# EAGLE design 10LA.org_Raspiado_Updated_Logo_Oct3 (EAGLE 7.1.0)

## Sheet 1 of 3
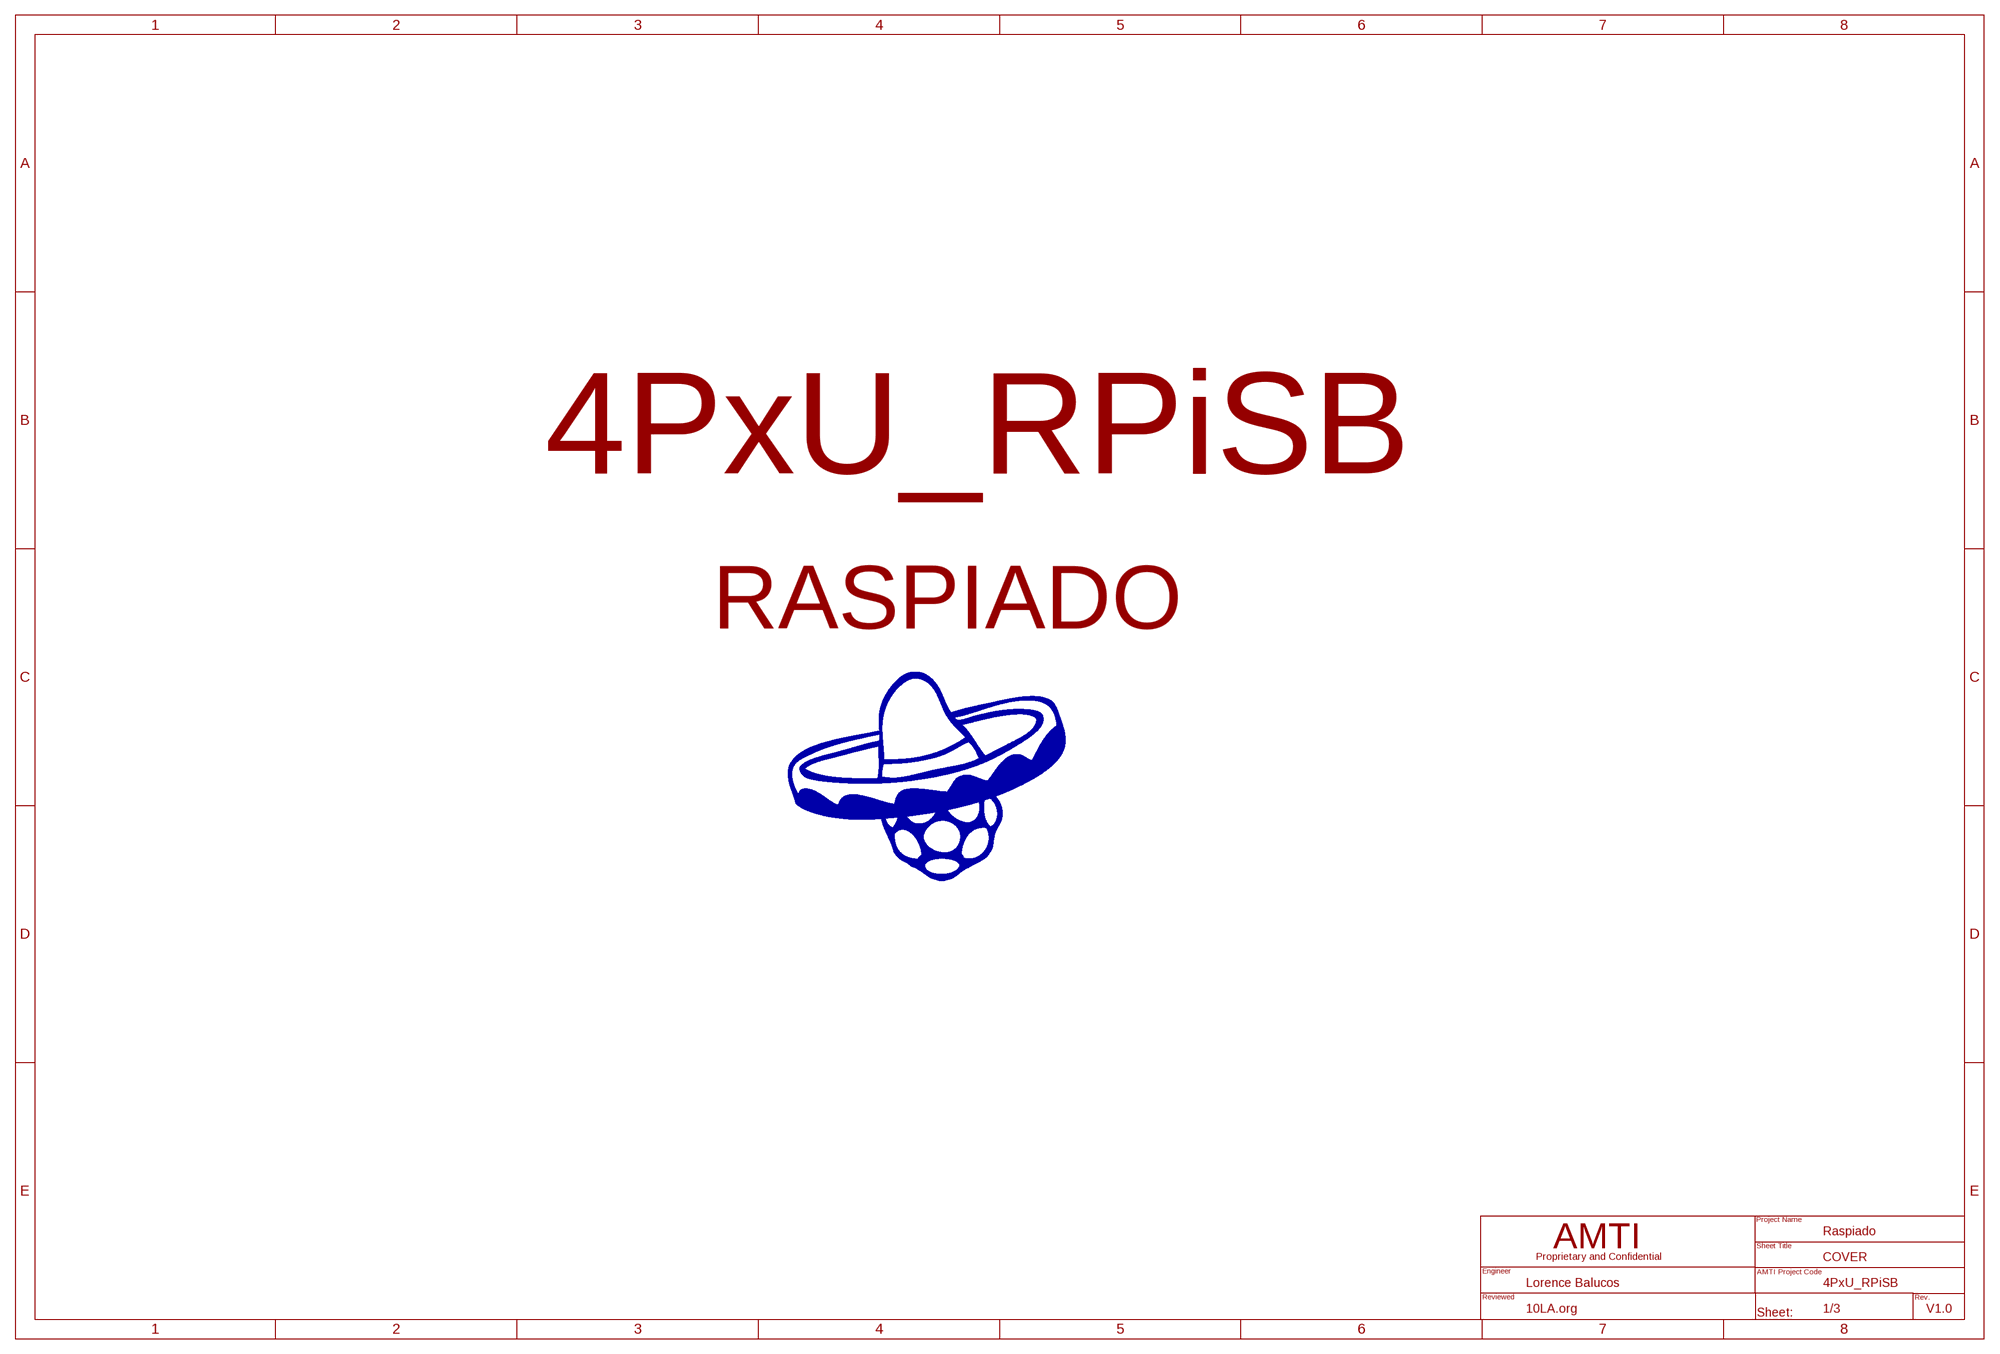
[diagram p0: schematic, sheet 1]

### Notes on the sheet
- 4PxU_RPiSB
- RASPIADO
- Raspiado
- COVER
- Lorence Balucos | 4PxU_RPiSB
- 10LA.org | 1/3 | V1.0

## Sheet 2 of 3
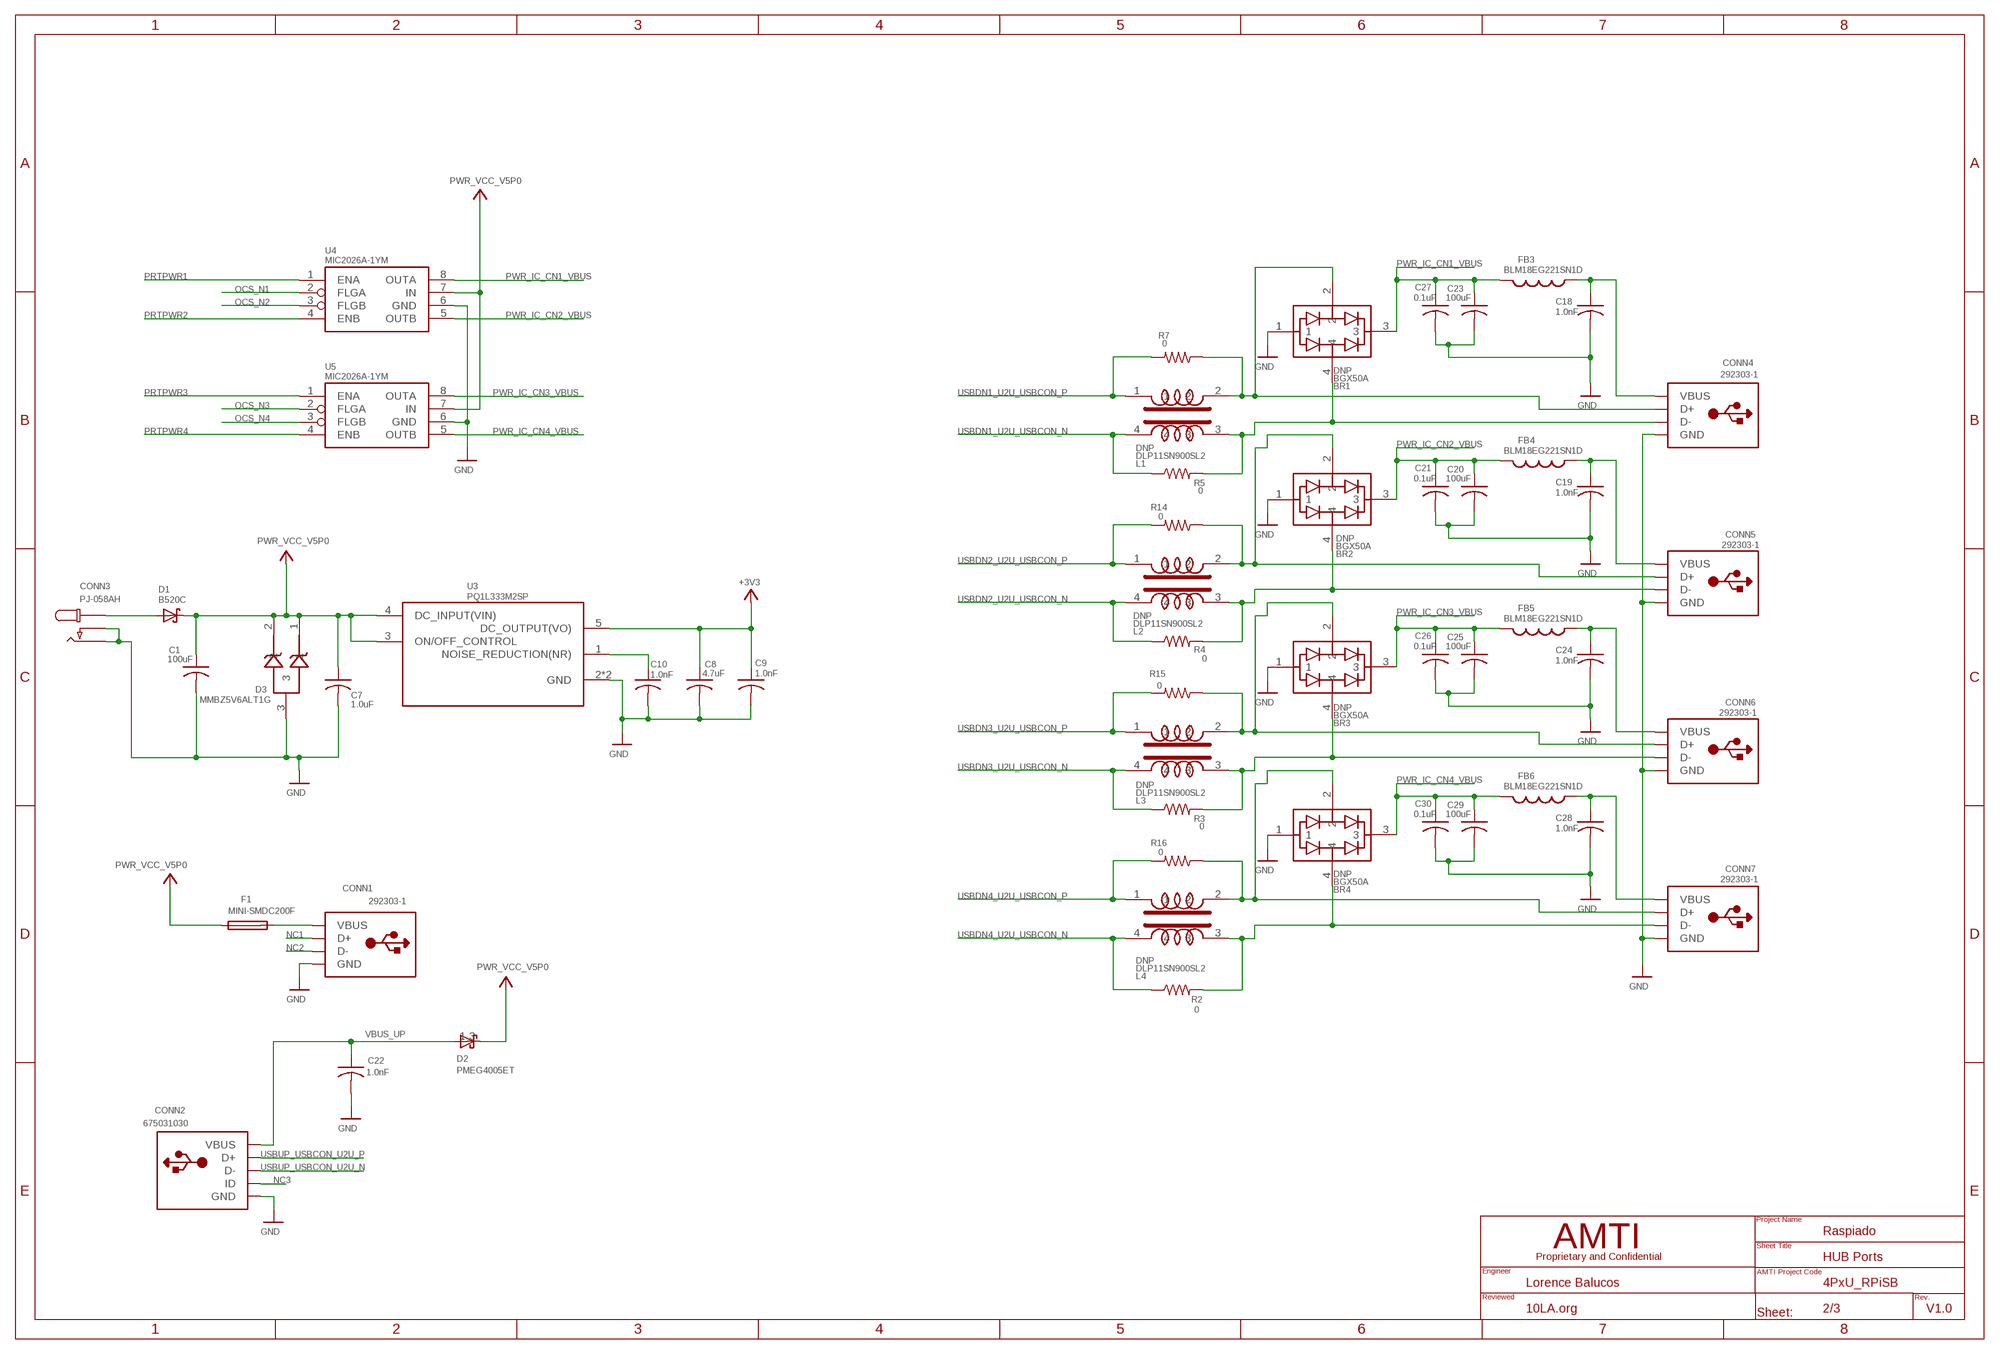
[diagram p1: schematic, sheet 2]

### Parts
BR1  BGX50A  [SOT-143]
BR2  BGX50A  [SOT-143]
BR3  BGX50A  [SOT-143]
BR4  BGX50A  [SOT-143]
C1  100uF  EMZA6R3ADA101ME61G  [RADIAL_SMT]
C7  1.0uF  C-USC0603  [C0603]
C8  4.7uF  C-USC0603  [C0603]
C9  1.0nF  C-USC0402  [0402]
C10  1.0nF  C-USC0402  [0402]
C18  1.0nF  C-USC0402  [0402]
C19  1.0nF  C-USC0402  [0402]
C20  100uF  EMZA6R3ADA101ME61G  [RADIAL_SMT]
C21  0.1uF  C-USC0402  [0402]
C22  1.0nF  C-USC0402  [0402]
C23  100uF  EMZA6R3ADA101ME61G  [RADIAL_SMT]
C24  1.0nF  C-USC0402  [0402]
C25  100uF  EMZA6R3ADA101ME61G  [RADIAL_SMT]
C26  0.1uF  C-USC0402  [0402]
C27  0.1uF  C-USC0402  [0402]
C28  1.0nF  C-USC0402  [0402]
C29  100uF  EMZA6R3ADA101ME61G  [RADIAL_SMT]
C30  0.1uF  C-USC0402  [0402]
CONN1  292303-1  USB_292303-1  [STYLEA,RIGHTANGLE,THROUGH-HOLE]
CONN2  675031030  675031030-USB_MINI-B  [MINI_B]
CONN3  PJ-058AH  [PJ-058AH]
CONN4  292303-1  USB_292303-1  [STYLEA,RIGHTANGLE,THROUGH-HOLE]
CONN5  292303-1  USB_292303-1  [STYLEA,RIGHTANGLE,THROUGH-HOLE]
CONN6  292303-1  USB_292303-1  [STYLEA,RIGHTANGLE,THROUGH-HOLE]
CONN7  292303-1  USB_292303-1  [STYLEA,RIGHTANGLE,THROUGH-HOLE]
D1  B520C  [B520C]
D2  PMEG4005ET  [SOT23]
D3  MMBZ5V6ALT1G  MMBZ_ALT1G  [SOT23]
F1  MINI-SMDC200F  MINI-SMDC-200F  [MINI-SMDC200F]
FB3  BLM18EG221SN1D  [C0603]
FB4  BLM18EG221SN1D  [C0603]
FB5  BLM18EG221SN1D  [C0603]
FB6  BLM18EG221SN1D  [C0603]
L1  DLP11SN900SL2  [0504]
L2  DLP11SN900SL2  [0504]
L3  DLP11SN900SL2  [0504]
L4  DLP11SN900SL2  [0504]
R2  0  R-US_R0402  [R0402]
R3  0  R-US_R0402  [R0402]
R4  0  R-US_R0402  [R0402]
R5  0  R-US_R0402  [R0402]
R7  0  R-US_R0402  [R0402]
R14  0  R-US_R0402  [R0402]
R15  0  R-US_R0402  [R0402]
R16  0  R-US_R0402  [R0402]
U3  PQ1L333M2SP  [PQ1L333M2SP]
U4  MIC2026A-1YM  [SO_08]
U5  MIC2026A-1YM  [SO_08]

### Nets
+3V3: C8.1 C9.1 U3.5(DC_OUTPUT(VO)) ; also sheet 3
GND: BR1.1 BR2.1 BR3.1 BR4.1 C1.- C7.2 C8.2 C9.2 C10.2 C18.2 C19.2 C20.- C21.2 C22.2 C23.- C24.2 C25.- C26.2 C27.2 C28.2 C29.- C30.2 CONN1.GND CONN1.GND1(GND) CONN1.GND2(GND) CONN2.GND CONN2.GND1(GND) CONN2.GND2(GND) CONN2.GND3(GND) CONN2.GND4(GND) CONN3.2 CONN3.3 CONN4.GND CONN4.GND1(GND) CONN4.GND2(GND) CONN5.GND CONN5.GND1(GND) CONN5.GND2(GND) CONN6.GND CONN6.GND1(GND) CONN6.GND2(GND) CONN7.GND CONN7.GND1(GND) CONN7.GND2(GND) D3.3 U3.2(GND) U3.P$3(GND) U4.6(GND) U5.6(GND) ; also sheet 3
N$6: C19.1 CONN5.VBUS FB4.1
N$7: BR2.2 CONN5.SIG2(D+) L2.2 R14.1
N$9: CONN3.1 D1.P$1
N$15: C10.1 U3.1(NOISE_REDUCTION(NR))
N$17: C18.1 CONN4.VBUS FB3.1
N$18: BR1.2 CONN4.SIG2(D+) L1.2 R7.1
N$19: CONN1.VBUS F1.2
N$25: C24.1 CONN6.VBUS FB5.1
N$27: BR3.2 CONN6.SIG2(D+) L3.2 R15.1
N$29: C28.1 CONN7.VBUS FB6.1
N$30: BR4.2 CONN7.SIG2(D+) L4.2 R16.1
NC1: CONN1.SIG2(D+)
NC2: CONN1.SIG1(D-)
NC3: CONN2.ID
OCS_N1: U4.2(FLGA) ; also sheet 3
OCS_N2: U4.3(FLGB) ; also sheet 3
OCS_N3: U5.2(FLGA) ; also sheet 3
OCS_N4: U5.3(FLGB) ; also sheet 3
PRTPWR1: U4.1(ENA) ; also sheet 3
PRTPWR2: U4.4(ENB) ; also sheet 3
PRTPWR3: U5.1(ENA) ; also sheet 3
PRTPWR4: U5.4(ENB) ; also sheet 3
PWR_IC_CN1_VBUS: BR1.3 C23.+ C27.1 FB3.2 U4.8(OUTA)
PWR_IC_CN2_VBUS: BR2.3 C20.+ C21.1 FB4.2 U4.5(OUTB)
PWR_IC_CN3_VBUS: BR3.3 C25.+ C26.1 FB5.2 U5.8(OUTA)
PWR_IC_CN4_VBUS: BR4.3 C29.+ C30.1 FB6.2 U5.5(OUTB)
USBDN1_U2U_USBCON_N: L1.4 R5.1 ; also sheet 3
USBDN1_U2U_USBCON_P: L1.1 R7.2 ; also sheet 3
USBDN1_U2U_USBCON_P2: BR4.4 CONN7.SIG1(D-) L4.3 R2.2
USBDN1_U2U_USBCON_P3: BR3.4 CONN6.SIG1(D-) L3.3 R3.2
USBDN1_U2U_USBCON_P4: BR2.4 CONN5.SIG1(D-) L2.3 R4.2
USBDN1_U2U_USBCON_P5: BR1.4 CONN4.SIG1(D-) L1.3 R5.2
USBDN2_U2U_USBCON_N: L2.4 R4.1 ; also sheet 3
USBDN2_U2U_USBCON_P: L2.1 R14.2 ; also sheet 3
USBDN3_U2U_USBCON_N: L3.4 R3.1 ; also sheet 3
USBDN3_U2U_USBCON_P: L3.1 R15.2 ; also sheet 3
USBDN4_U2U_USBCON_N: L4.4 R2.1 ; also sheet 3
USBDN4_U2U_USBCON_P: L4.1 R16.2 ; also sheet 3
USBUP_USBCON_U2U_N: CONN2.D- ; also sheet 3
USBUP_USBCON_U2U_P: CONN2.D+ ; also sheet 3
VBUS_UP: C22.1 CONN2.VBUS D2.1 ; also sheet 3
VCC: C1.+ C7.1 D1.P$2 D2.3 D3.1 D3.2 F1.1 U3.3(ON/OFF_CONTROL) U3.4(DC_INPUT(VIN)) U4.7(IN) U5.7(IN) ; supply symbol labelled PWR_VCC_V5P0

### Notes on the sheet
- Raspiado
- HUB Ports
- Lorence Balucos | 4PxU_RPiSB
- 10LA.org | 2/3 | V1.0

## Sheet 3 of 3
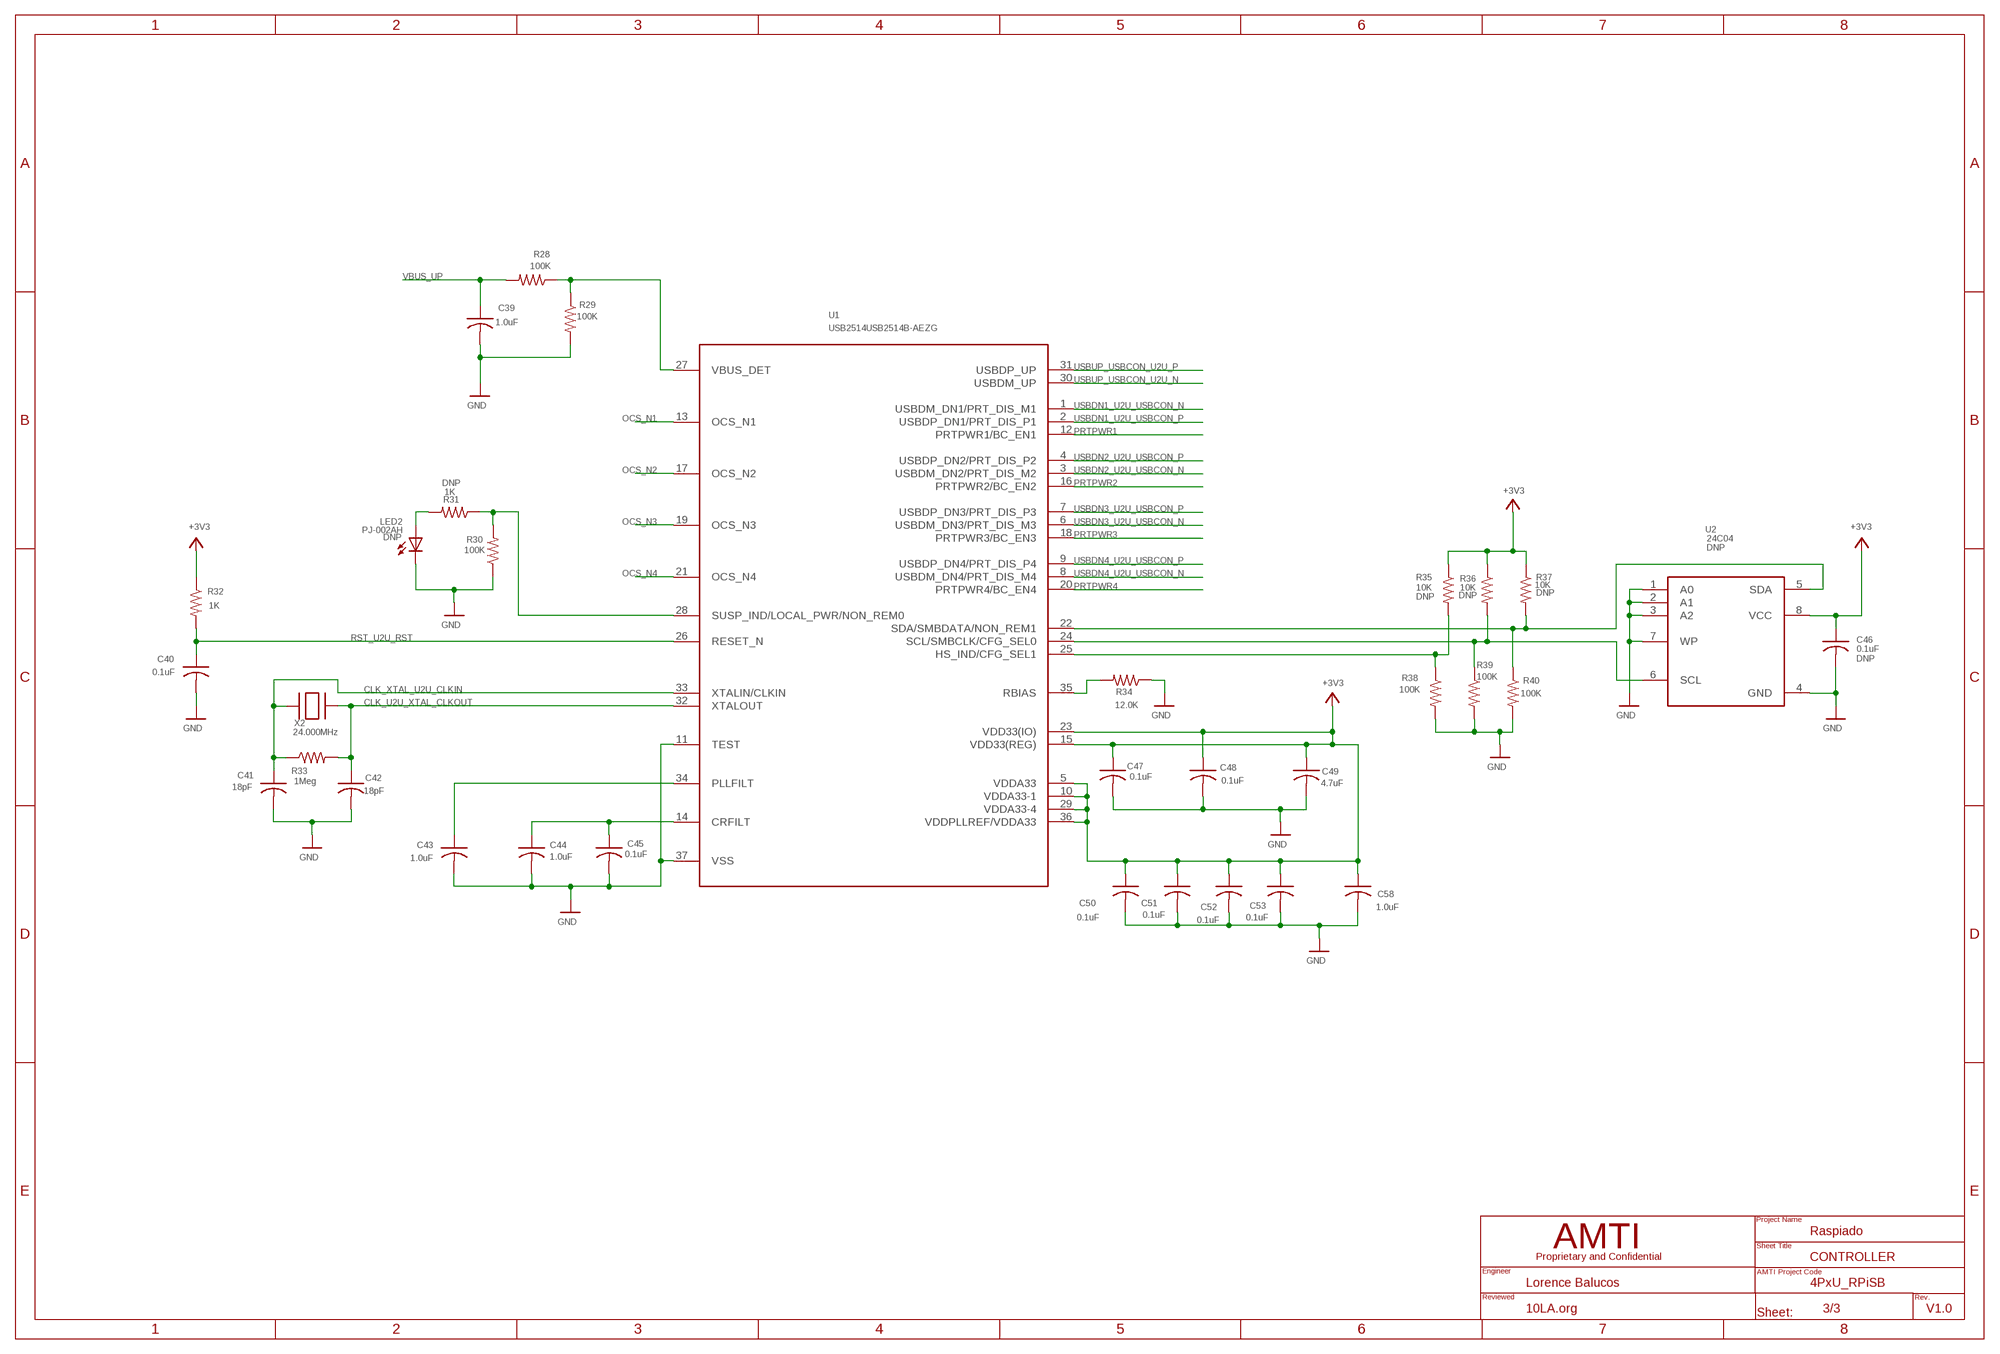
[diagram p2: schematic, sheet 3]

### Parts
C39  1.0uF  C-USC0603  [C0603]
C40  0.1uF  C-USC0402  [0402]
C41  18pF  C-USC0402  [0402]
C42  18pF  C-USC0402  [0402]
C43  1.0uF  C-USC0402  [0402]
C44  1.0uF  C-USC0402  [0402]
C45  0.1uF  C-USC0402  [0402]
C46  0.1uF  C-USC0402  [0402]
C47  0.1uF  C-USC0402  [0402]
C48  0.1uF  C-USC0402  [0402]
C49  4.7uF  C-USC0603  [C0603]
C50  0.1uF  C-USC0402  [0402]
C51  0.1uF  C-USC0402  [0402]
C52  0.1uF  C-USC0402  [0402]
C53  0.1uF  C-USC0402  [0402]
C58  1.0uF  C-USC0603  [C0603]
LED2  PJ-002AH  LEDCHIPLED_0603  [0603]
R28  100K  R-US_R0603  [R0603]
R29  100K  R-US_R0603  [R0603]
R30  100K  R-US_R0603  [R0603]
R31  1K  R-US_R0603  [R0603]
R32  1K  R-US_R0603  [R0603]
R33  1Meg  R-US_R0603  [R0603]
R34  12.0K  R-US_R0603  [R0603]
R35  10K  R-US_R0603  [R0603]
R36  10K  R-US_R0603  [R0603]
R37  10K  R-US_R0603  [R0603]
R38  100K  R-US_R0603  [R0603]
R39  100K  R-US_R0603  [R0603]
R40  100K  R-US_R0603  [R0603]
U1  USB2514USB2514B-AEZG  [QFN36]
U2  24C04  [SO-8]
X2  24.000MHz  HCM49-24.000MABJ-UT  [HC-49SMT]

### Nets
+3V3: C46.1 C47.1 C48.1 C49.1 C50.1 C51.1 C52.1 C53.1 C58.1 R32.1 R35.1 R36.1 R37.1 U1.5(VDDA33) U1.10(VDDA33-1) U1.15(VDD33(REG)) U1.23(VDD33(IO)) U1.29(VDDA33-4) U1.36(VDDPLLREF/VDDA33) U2.8(VCC) ; also sheet 2
CLK_U2U_XTAL_CLKOUT: C42.1 R33.2 U1.32(XTALOUT) X2.2
CLK_XTAL_U2U_CLKIN: C41.1 R33.1 U1.33(XTALIN/CLKIN) X2.1
CRFILT: C44.1 C45.1 U1.14(CRFILT)
GND: C39.2 C40.2 C41.2 C42.2 C43.2 C44.2 C45.2 C46.2 C47.2 C48.2 C49.2 C50.2 C51.2 C52.2 C53.2 C58.2 LED2.C R29.2 R30.1 R34.1 R38.2 R39.2 R40.2 U1.11(TEST) U1.37(VSS) U2.1(A0) U2.2(A1) U2.3(A2) U2.4(GND) U2.7(WP) ; also sheet 2
N$37: LED2.A R31.2
OCS_N1: U1.13(OCS_N1) ; also sheet 2
OCS_N2: U1.17(OCS_N2) ; also sheet 2
OCS_N3: U1.19(OCS_N3) ; also sheet 2
OCS_N4: U1.21(OCS_N4) ; also sheet 2
PLLFILT: C43.1 U1.34(PLLFILT)
PRTPWR1: U1.12(PRTPWR1/BC_EN1) ; also sheet 2
PRTPWR2: U1.16(PRTPWR2/BC_EN2) ; also sheet 2
PRTPWR3: U1.18(PRTPWR3/BC_EN3) ; also sheet 2
PRTPWR4: U1.20(PRTPWR4/BC_EN4) ; also sheet 2
RBIAS: R34.2 U1.35(RBIAS)
REM0: R30.2 R31.1 U1.28(SUSP_IND/LOCAL_PWR/NON_REM0)
REM1: R37.2 R40.1 U1.22(SDA/SMBDATA/NON_REM1) U2.5(SDA)
RST_U2U_RST: C40.1 R32.2 U1.26(RESET_N)
SCL: R36.2 R39.1 U1.24(SCL/SMBCLK/CFG_SEL0) U2.6(SCL)
SEL1: R35.2 R38.1 U1.25(HS_IND/CFG_SEL1)
USBDN1_U2U_USBCON_N: U1.1(USBDM_DN1/PRT_DIS_M1) ; also sheet 2
USBDN1_U2U_USBCON_P: U1.2(USBDP_DN1/PRT_DIS_P1) ; also sheet 2
USBDN2_U2U_USBCON_N: U1.3(USBDM_DN2/PRT_DIS_M2) ; also sheet 2
USBDN2_U2U_USBCON_P: U1.4(USBDP_DN2/PRT_DIS_P2) ; also sheet 2
USBDN3_U2U_USBCON_N: U1.6(USBDM_DN3/PRT_DIS_M3) ; also sheet 2
USBDN3_U2U_USBCON_P: U1.7(USBDP_DN3/PRT_DIS_P3) ; also sheet 2
USBDN4_U2U_USBCON_N: U1.8(USBDM_DN4/PRT_DIS_M4) ; also sheet 2
USBDN4_U2U_USBCON_P: U1.9(USBDP_DN4/PRT_DIS_P4) ; also sheet 2
USBUP_USBCON_U2U_N: U1.30(USBDM_UP) ; also sheet 2
USBUP_USBCON_U2U_P: U1.31(USBDP_UP) ; also sheet 2
VBUS_UP: C39.1 R28.2 ; also sheet 2
VBUS_UPSTREAM: R28.1 R29.1 U1.27(VBUS_DET)

### Notes on the sheet
- Raspiado
- CONTROLLER
- Lorence Balucos | 4PxU_RPiSB
- 10LA.org | 3/3 | V1.0

## Library data of the parts
BR1-BR4 = AMTI LIBRARY:BGX50A; DESCRIPTION: Diode, Bridge, Switching, 50v, 140mA, KCAC, SOT-143; LOAD_OPTION: DNP
C1 C20 C23 C25 C29 = AMTI LIBRARY:EMZA6R3ADA101ME61G: Capacitor, Low ESR, 100uF, 6.3VDC, 20%, Aluminum, Radial-SMT, 5mm x 5.8mm; DESCRIPTION: Capacitor, Low ESR, 100uF, 6.3VDC, 20%, Aluminum, Radial-SMT, 5mm x 5.8mm
C7 C39 C43 C44 C58 = AMTI LIBRARY:C-US; DESCRIPTION: Capacitor, 1.0uF, 10%, 6.3V, X5R, 0603
C8 C49 = AMTI LIBRARY:C-US; DESCRIPTION: Capacitor, 4.7uF, 6.3VDC, 20%, X5R, 0603
C9 C10 C18 C19 C22 C24 C28 = AMTI LIBRARY:C-US; DESCRIPTION: Capacitor, 1.0nF, 50VDC, 5%, Standard, 0402
C21 C26 C27 C30 C40 C45 C47 C48 C50-C53 = AMTI LIBRARY:C-US; DESCRIPTION: Capacitor, 0.1uF, 6.3V, 10%, X5R, 0402
C41 C42 = AMTI LIBRARY:C-US; DESCRIPTION: Capacitor, 18pF, 50V, 5%, NPO, 0402
C46 = AMTI LIBRARY:C-US; DESCRIPTION: Capacitor, 0.1uF, 6.3V, 10%, X5R, 0402; LOAD_OPTION: DNP
CONN1 CONN4-CONN7 = AMTI LIBRARY:USB_292303-1: Connector, USB, Style A, Right Angle, Through-hole; DESCRIPTION: Connector, USB, Style A, Right Angle, Through-hole
CONN2 = AMTI LIBRARY:675031030-USB_MINI-B: Connector, 675031030-USB_MINI-B; DESCRIPTION: Connector, 675031030-USB_MINI-B
CONN3 = AMTI LIBRARY:PJ-058AH: CON PWR JCK 2.0 X 5.7MM
D1 = AMTI LIBRARY:B520C: Diode, 5.0A SURFACE MOUNT SCHOTTKY BARRIER RECTIFIER; DESCRIPTION: Diode, 5.0A SURFACE MOUNT SCHOTTKY BARRIER RECTIFIER
D2 = AMTI LIBRARY:PMEG4005ET: Diode ,0.5 A,MEGA Schottky barrier rectifiers,SOT23; DESCRIPTION: Diode ,0.5 A,MEGA Schottky barrier rectifiers,SOT23
D3 = AMTI LIBRARY:MMBZ_ALT1G: Diode, TVS, Arrays 5.6V 225mW Dual Common Anode; DESCRIPTION: Diode, TVS, Arrays 5.6V 225mW Dual Common Anode
F1 = AMTI LIBRARY:MINI-SMDC-200F: Fuse, PPTC 2A 8V 100A; DESCRIPTION: Fuse, PPTC 2A 8V 100A
FB3-FB6 = AMTI LIBRARY:BLM18EG221SN1D: Ferrite Bead, 220 Ohm, 2A, 0.05DCR, 0603; DESCRIPTION: Ferrite Bead, 220 Ohm, 2A, 0.05DCR, 0603
L1-L4 = AMTI LIBRARY:DLP11SN900SL2: Inductor, Common Mode Choke, DLP11SN900SL2, 0504; DESCRIPTION: Inductor, Common Mode Choke, DLP11SN900SL2, 0504; LOAD_OPTION: DNP
LED2 = AMTI LIBRARY:LED: LED CHIPLED 0603; DESCRIPTION: LED, CHIPLED 0603; LOAD_OPTION: DNP
R2-R5 R7 R14-R16 = AMTI LIBRARY:R-US_; DESCRIPTION: Resistor, 0ohm,0402
R28-R30 R38-R40 = AMTI LIBRARY:R-US_; DESCRIPTION: Resistor, 100K, 5%, 1/16W, 0603
R31 = AMTI LIBRARY:R-US_; DESCRIPTION: Resistor, 1K, 5%, 1/16W, 0603; LOAD_OPTION: DNP
R32 = AMTI LIBRARY:R-US_; DESCRIPTION: Resistor, 1K, 5%, 1/16W, 0603
R33 = AMTI LIBRARY:R-US_; DESCRIPTION: Resistor, 1Meg, 5%, 1/16W, 0603
R34 = AMTI LIBRARY:R-US_; DESCRIPTION: Resistor, 12.0K, 1%, 1/16W, 0603
R35-R37 = AMTI LIBRARY:R-US_; DESCRIPTION: Resistor, 10.0K, 1%, 1/16W, 0603; LOAD_OPTION: DNP
U1 = AMTI LIBRARY:USB2514: IC, USB2514B, 4 Port USB 2.0 Hub, QFN36; DESCRIPTION: IC, USB2514B, 4 Port USB 2.0 Hub, QFN36
U2 = AMTI LIBRARY:24C04: IC, EEPROM,3V to 5.5V for ST24x04,; DESCRIPTION: IC, EEPROM,3V to 5.5V for ST24x04,; LOAD_OPTION: DNP
U3 = AMTI LIBRARY:PQ1L333M2SP: IC, EEPROM,3V to 5.5V for ST24x04,; DESCRIPTION: IC, PQ1L333M2SP, Voltage Regulator, 3.3V, 300mA, Low Dropout, 900mW, SOT-89-5
U4 U5 = AMTI LIBRARY:MIC2026*-1Y: IC, MIC2026A-1YM, Power Distribution Switch, SO-8; DESCRIPTION: IC, MIC2026A-1YM, Power Distribution Switch, SO-8
X2 = AMTI LIBRARY:HCM49-24.000MABJ-UT: Crystal, 24.000MHz, 50ppm, 18pF, HC-49SMT; DESCRIPTION: Crystal, 24.000MHz, 50ppm, 18pF, HC-49SMT

## Net classes
0 default: width 0.178 mm, drill 0.4 mm, clearance 0.178 mm

## Board
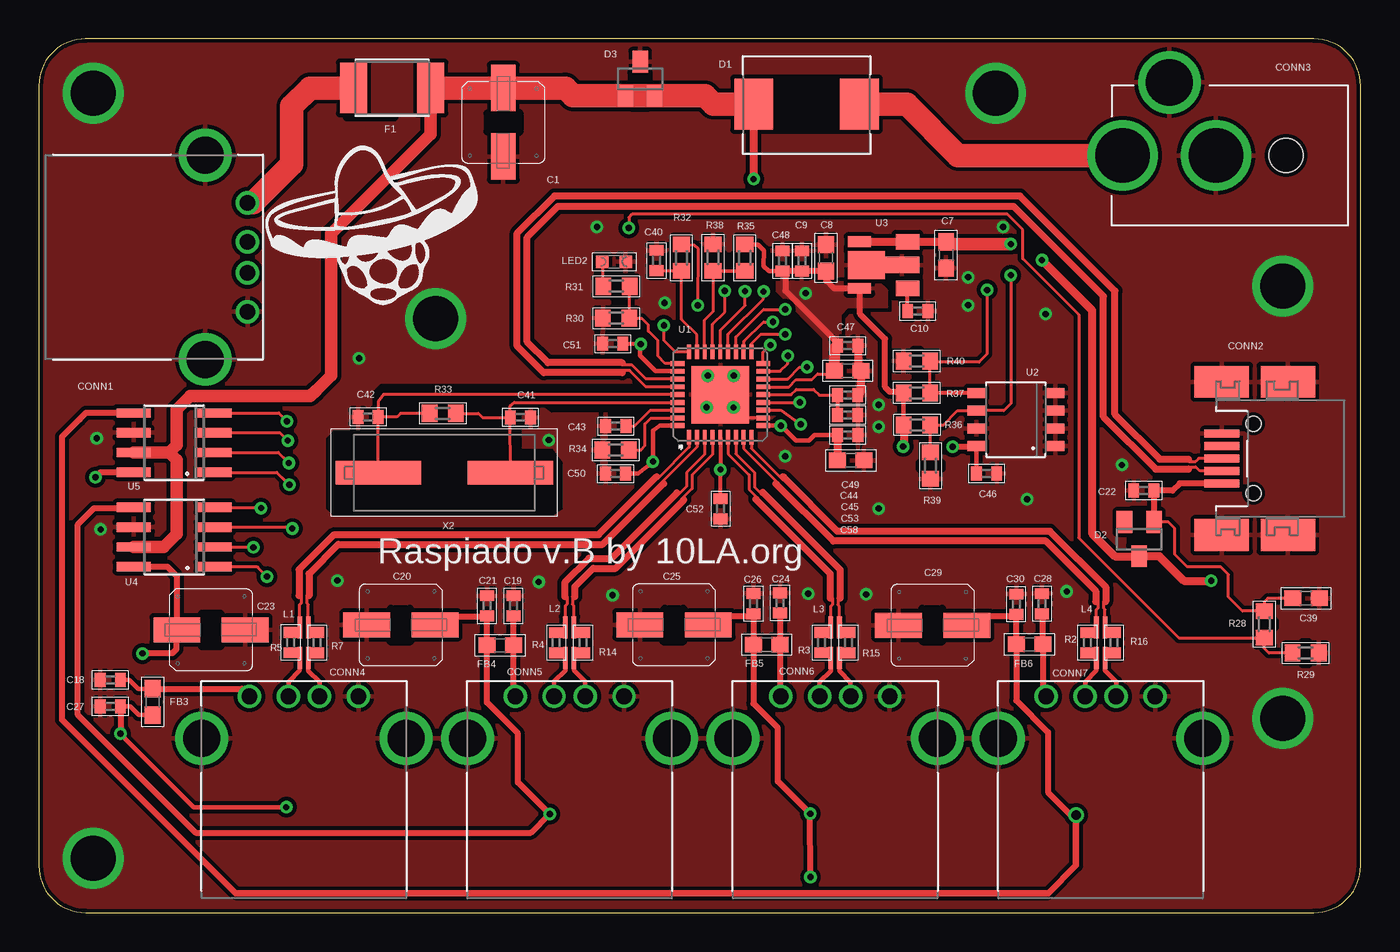
[diagram p3: board, top side]
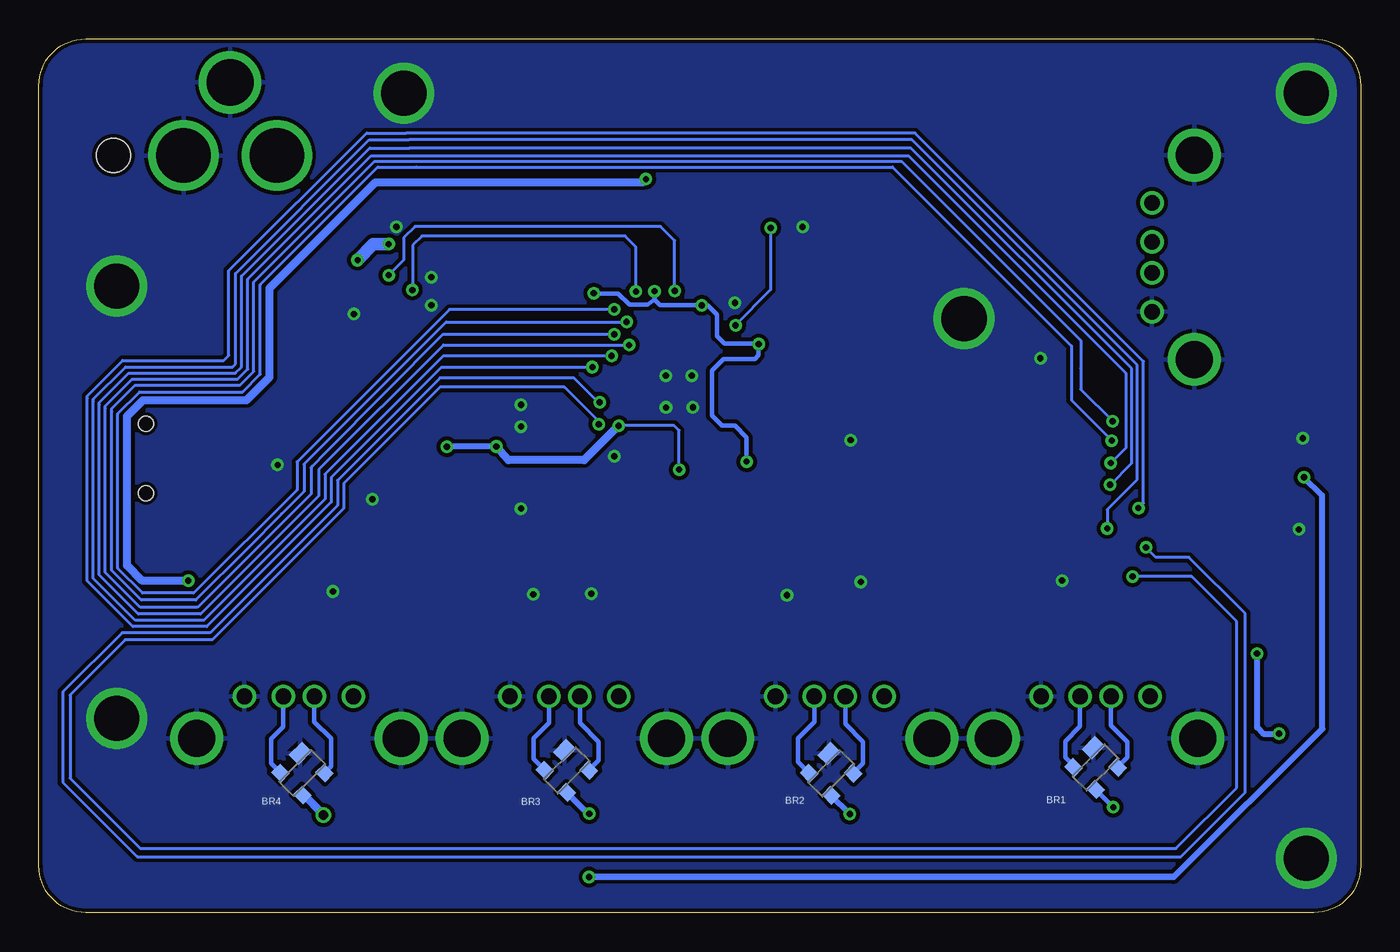
[diagram p4: board, bottom side, seen from below]

Size 85 x 56.2 mm. Coordinates in mm from the lower left corner, seen from the top.
Outline: 3,56.2 arc90 0,53.2 0,3 arc90 3,0 82,0 arc90 85,3 85,53.2 arc90 82,56.2 2.99,56.2
Copper layers (1*16): Top 0.035mm / dielectric 1.5mm / Bottom 0.035mm
Design rules "default *": minimum track width 7mil, minimum drill 12mil, track to track 7mil, track to pad 7mil, pad to pad 7mil, via to via 7mil, smd to smd 7mil, copper to edge 10mil, drill to drill 8mil, minimum pad ring 10mil, minimum via ring 8mil, stop-mask expansion 4mil, vias tented up to drill 0mil, thermal gap 10mil
tRestrict: 20 lines

### Footprints (pad centres in the part's own frame; a part is rotated, then mirrored left to right if it is on the bottom)
SOT-143 = smd 1.2 x 0.9: 1 -0.8,-1 | smd 0.8 x 0.9: 2 1,-1; 3 1,1; 4 -1,1
RADIAL_SMT = smd 3 x 1.6: + 2.2,0; - -2.2,0
C0603 = smd 1.1 x 1: 1 -0.85,0; 2 0.85,0
0402 = smd 0.7 x 0.9: 1 -0.65,0; 2 0.65,0
STYLEA,RIGHTANGLE,THROUGH-HOLE = drill 1: GND 3.5,2.71; SIG1 -1,2.71; SIG2 1,2.71; VBUS -3.5,2.71 | drill 2.38: GND1 -6.57,0; GND2 6.57,0
MINI_B = smd 0.5 x 2.25: D+ 0.06,4.34; D- -0.74,4.34; GND 1.66,4.34; ID 0.86,4.34; VBUS -1.54,4.34 | smd 2.05 x 3.5: GND1 -4.87,0.09; GND2 -4.87,4.34; GND3 4.99,4.34; GND4 4.99,0.09 | hole 0.95: -2.17,2.29; 2.29,2.29
PJ-058AH = drill 3.5: 1 6,0; 2 0,0 | drill 3: 3 3,-4.7 | hole 2.2: -4.5,0
B520C = smd 2.5 x 3.3: P$1 -3.4,0; P$2 3.4,0
SOT23 = smd 1 x 1.4: 1 -0.95,-1.1; 2 0.95,-1.1; 3 0,1.1
MINI-SMDC200F = smd 1.74 x 3.27: 1 -2.48,0; 2 2.48,0
0504 = smd 1.4 x 0.3: 1 -0.975,0.275; 2 0.975,0.275; 3 0.975,-0.275; 4 -0.975,-0.275
0603 = smd 0.8 x 0.8: A 0,-0.75; C 0,0.75
R0402 = smd 0.7 x 0.9: 1 -0.65,0; 2 0.65,0
R0603 = smd 1 x 1.1: 1 -0.85,0; 2 0.85,0
QFN36 = smd 0.9 x 0.28: 1 -2.75,2; 2 -2.75,1.5; 3 -2.75,1; 4 -2.75,0.5; 5 -2.75,0; 6 -2.75,-0.5; 7 -2.75,-1; 8 -2.75,-1.5; 9 -2.75,-2; 19 2.75,-2; 20 2.75,-1.5; 21 2.75,-1; 22 2.75,-0.5; 23 2.75,0; 24 2.75,0.5; 25 2.75,1; 26 2.75,1.5; 27 2.75,2 | smd 0.28 x 0.9: 10 -2,-2.75; 11 -1.5,-2.75; 12 -1,-2.75; 13 -0.5,-2.75; 14 0,-2.75; 15 0.5,-2.75; 16 1,-2.75; 17 1.5,-2.75; 18 2,-2.75; 28 2,2.75; 29 1.5,2.75; 30 1,2.75; 31 0.5,2.75; 32 0,2.75; 33 -0.5,2.75; 34 -1,2.75; 35 -1.5,2.75; 36 -2,2.75 | smd 3.7 x 3.7: 37 0,0
SO-8 = smd 0.64 x 1.14: 1 -1.71,-2.54; 2 -0.57,-2.54; 3 0.57,-2.54; 4 1.71,-2.54; 5 1.71,2.54; 6 0.57,2.54; 7 -0.57,2.54; 8 -1.71,2.54
PQ1L333M2SP = smd 1 x 1.5: 1 -1.48,-1.69; 3 1.52,-1.69 | smd 1.05 x 2.2: 2 0.02,-1.34 | smd 0.7 x 1.5: 4 1.52,1.41; 5 -1.48,1.41 | smd 1.8 x 2.4: P$3 0.02,0.96
SO_08 = smd 0.6 x 2.2: 1 -1.905,-2.6; 2 -0.635,-2.6; 3 0.635,-2.6; 4 1.905,-2.6; 5 1.905,2.6; 6 0.635,2.6; 7 -0.635,2.6; 8 -1.905,2.6
HC-49SMT = smd 5.5 x 1.5: 1 -4.25,0; 2 4.25,0

### Placement (x,y rotation side)
BR1  17.05,9.34 225 bottom
BR2  34.05,8.96 225 bottom
BR3  51.05,9.15 225 bottom
BR4  68.05,8.98 225 bottom
C1  29.86,50.84 90 top
C7  58.34,42.3 270 top
C8  50.62,42.12 90 top
C9  49.09,41.91 90 top
C10  56.52,38.7 0 top
C18  4.59,14.97 180 top
C19  30.52,19.73 90 top
C20  23.28,18.5 0 top
C21  28.82,19.73 90 top
C22  71.05,27.15 180 top
C23  11.07,18.19 180 top
C24  47.66,19.91 90 top
C25  40.84,18.51 0 top
C26  45.95,19.87 90 top
C27  4.59,13.27 180 top
C28  64.51,19.86 90 top
C29  57.48,18.48 0 top
C30  62.85,19.84 90 top
C39  81.49,20.21 0 top
C40  39.72,41.95 90 top
C41  30.96,31.86 0 top
C42  21.18,31.89 180 top
C43  37.1,31.29 180 top
C44  52.01,33.29 0 top
C45  52.01,32.01 0 top
C46  60.95,28.24 0 top
C47  52.02,36.46 0 top
C48  47.82,41.91 90 top
C49  52.02,34.84 0 top
C50  37.08,28.23 180 top
C51  36.9,36.59 180 top
C52  43.84,25.98 270 top
C53  52.02,30.72 0 top
C58  52.22,29.09 0 top
CONN1  10.71,42.16 270 top
CONN2  80.41,29.15 90 top
CONN3  75.7,48.7 180 top
CONN4  17.05,11.2 0 top
CONN5  34.13,11.2 0 top
CONN6  51.2,11.2 0 top
CONN7  68.28,11.2 0 top
D1  49.37,52 180 top
D2  70.75,24.02 180 top
D3  38.67,53.63 0 top
F1  22.72,53.04 180 top
FB3  7.32,13.55 270 top
FB4  29.66,17.19 180 top
FB5  46.8,17.23 180 top
FB6  63.7,17.25 180 top
L1  17.05,17.36 270 top
L2  34.13,17.36 270 top
L3  51.2,17.36 270 top
L4  68.28,17.36 270 top
LED2  36.99,41.87 270 top
R2  67.43,17.36 270 top
R3  50.34,17.37 270 top
R4  33.27,17.36 270 top
R5  16.19,17.38 270 top
R7  17.91,17.36 90 top
R14  34.99,17.36 90 top
R15  52.06,17.36 90 top
R16  69.14,17.36 90 top
R28  78.81,18.55 90 top
R29  81.46,16.7 0 top
R30  37.12,38.23 0 top
R31  37.14,40.28 180 top
R32  41.31,42.12 270 top
R33  25.98,32.12 180 top
R34  37.09,29.76 0 top
R35  45.4,42.12 270 top
R36  56.48,31.38 0 top
R37  56.45,33.43 0 top
R38  43.36,42.13 90 top
R39  57.34,28.75 270 top
R40  56.46,35.48 180 top
U1  43.82,33.32 90 top
U2  62.83,31.72 90 top
U3  54.17,41.63 90 top
U4  8.7,24.16 90 top
U5  8.69,30.23 90 top
U$1  [FRAME]  501.13,-284.41 0 top  (outside the outline)
X2  26.07,28.3 180 top

### Tracks (layer width: path | path; a pad name or v marks a point on that pad's centre or on a via)
+3V3  (via drill 0.4, 0.4 pad 0.7)
  Top 0.178: U1.5 | v43.82,28.51 v43.83,28.5 | R32.1 42.12,42.95 42.38,42.72 v42.37,39.06 | U1.15 48.24,33.82 48.7,34.28 49.7,34.28 50.07,34.65 51.16,34.65 C49.1 | R36.1 55.62,33.38 55.5,33.5
  Top 0.203: 37.76,36.6 C51.1 | U1.23 43.84,37.47 45.42,39.05 v45.4,39.96 v45.41,39.97
  Top 0.25: C52.1 43.84,28.2 v43.83,28.5 | U1.5 v43.82,28.51 | C51.1 38.65,36.59 v38.71,36.57
  Top 0.3: C50.1 38.53,28.23 39.5,28.99 39.5,31 39.93,31.32 U1.36 | U1.10 v47.72,31.32 48.68,30.36 49.53,30.36 49.89,30.72 C53.1 | R37.1 55.6,31.39 R36.1 | 51.35,29.14 C58.1 | C48.1 46.96,41.27 46.61,41.59 46.62,42.57 46.25,42.96 R35.1 | C46.1 U2.8 | v38.71,36.57 38.66,36.48 38.66,35.84 39.67,34.82 U1.29
  Top 0.4: 51.21,36.34 C47.1 51.14,36.84 51.12,36.86 51.12,36.88 48,40 48,41.23 C48.1 C9.1 C8.1 50.63,40.65 51.14,40.14 U3.5 | 55.5,33.5 54.73,33.5 54.42,33.81 54.42,36.9 52.81,38.51 52.81,40.11 | v58.76,29.97 60.24,29.97 U2.8
  Top 0.5: 52.81,40.11 U3.5 | R36.1 55.62,29.93 v55.58,29.98 | C53.1 C58.1
  Top 0.7: C49.1 51.21,36.34 | U3.5
  Bottom 0.178: v43.83,28.5 43.83,31.01 44.14,31.32 v47.72,31.32 | v42.37,39.06 42.31,39.08
  Bottom 0.254: U1.36 40.44,31.32 40.44,31.34 41.07,31.34 U1.36
  Bottom 0.3: v39.49,29.01 39.49,30.49 39.5,30.5 39.5,30.57 40.25,31.32 U1.36 41.72,31.97 41.72,34.86 40.96,35.62 38.94,35.62 38.71,35.85 v38.71,36.57 | 45.43,40.02 v45.41,39.97 45.41,39.42 | 49.12,40.03 v49.31,39.84 v49.3,39.83 47.76,39.83 47.03,39.1 45.86,39.1 45.41,39.42 | 45.41,39.42 45.07,39.08 42.31,39.08 41.99,39.08 41.38,38.47 41.38,37.09 40.9,36.61 38.66,36.61 v38.71,36.57 | v38.71,36.57 38.98,36.6
  Bottom 0.4: v55.58,29.98 58.67,29.98 v58.76,29.97
  Bottom 0.5: v47.72,31.32 49.93,29.11 54.81,29.11 v55.58,29.98
  pour Top (isolate 0.254): 51.5,35.5 51.5,38.5 52,39 54.52,39 54.5,40 54,40.5 51.5,40.5 51,41 51,41.5 47.5,41.5 47.5,40 50.5,37 50.5,35.5
CLK_U2U_XTAL_CLKOUT
  Top 0.18: U1.32 22.16,33.33 21.82,32.85 C42.1 | X2.2 C42.1 | R33.2 23.25,32.12 23.03,31.89 C42.1
CLK_XTAL_U2U_CLKIN
  Top 0.18: X2.1 C41.1 | C41.1 30.31,32.57 30.58,32.82 U1.33 | R33.1 28.27,32.12 28.52,31.86 C41.1
CRFILT
  Top 0.178: U1.14 48.37,33.32 48.71,33.66 49.82,33.66 50.19,33.29 C44.1
  Top 0.25: C44.1 C45.1
  Top 0.5: C45.1
GND  (via drill 0.4, 2.9)
  Top 0.178: U1.11 45.68,31.82 45.5,32 45.14,32 | 45.14,32 U1.37 | 45.14,32 44.67,32 v44.67,32.49
  Top 0.5: C47.2 52.67,34.84 C49.2 52.87,33.47 C44.2
  other vias: 3.5,3.5 43.01,34.54 44.68,34.54 42.94,32.5 40.24,39.22 48,29.36 35.89,44.11 59.76,39.07 54,25.99 3.72,30.51 3.97,24.65 19.2,21.36 32.14,21.27 36.89,20.42 49.48,20.52 53.2,20.47 66.1,20.66 54,32.66 64.74,38.5 20.59,35.65 32.79,30.39 80,40.3 54,31.26 80,12.5 59.76,40.87 62.01,44.11 69.65,28.8 63.55,26.59 61.53,52.7 3.5,52.7 25.5,38.2
  pour Bottom (isolate 0.254, rank 6): -0.01,56.31 85.01,56.31 85.01,-0.01 0.1,-0.01
  pour Top (isolate 0.254, rank 6): -0.01,56.31 85.01,56.31 85.01,-0.01 -0.01,0.01
N$6
  Top 0.4: CONN5.VBUS 30.52,14.03 FB4.1 C19.1
N$7
  Top 0.178: R14.1 34.73,16.71 L2.2
  Top 0.3: L2.2 34.41,15.59 35.13,14.86 CONN5.SIG2
  Bottom 0.3: BR2.2 36.2,9.7 36.2,11.2 35.13,12.27 CONN5.SIG2
N$9
  Top 1.5: CONN3.1 59.11,48.7 55.81,52 D1.P$1
N$13
  cutout Top: 39.5,32.5 39.01,32.5 38.68,32.22 38.55,32.21 33,32.18 32.63,32.46 31,32.5 31,29.81 33,29.81 33.64,28.96 33.64,25.96 33,25.5 19,25.5 18.5,26 18.5,30.5 19,31 21,31 21.5,31.5 21.5,33.5 22,34 38,34 39,33 39,32.5 38.99,33.01
N$15
  Top 0.25: C10.1 55.87,38.92 U3.1
N$17
  Top 0.3: C18.1 5.82,14.97 6.4,14.39 7.3,14.39 FB3.1
  Top 0.4: FB3.1 13.05,14.4 CONN4.VBUS
N$18
  Top 0.178: R7.1 17.65,16.71 L1.2
  Top 0.3: L1.2 17.32,15.56 18.05,14.84 CONN4.SIG2
  Bottom 0.178: BR1.2 18.46,9.46
  Bottom 0.3: 18.46,9.46 19,10 19,11.03 18.05,11.98 CONN4.SIG2
N$19
  Top 1.5: F1.2 17.44,53.04 16.26,51.86 16.26,48.14 13.78,45.66 CONN1.VBUS
N$25
  Top 0.4: C24.1 FB5.1 47.66,13.96 CONN6.VBUS
N$27
  Top 0.178: R15.1 51.8,16.71 L3.2
  Top 0.3: L3.2 51.48,15.54 52.2,14.82 CONN6.SIG2
  Bottom 0.3: BR3.2 53.2,9.89 53.2,11.2 52.2,12.2 CONN6.SIG2
N$29
  Top 0.4: C28.1 64.56,19.17 FB6.1 64.56,14.14 CONN7.VBUS
N$30
  Top 0.178: R16.1 68.89,16.71 L4.2
  Top 0.3: L4.2 68.56,15.58 69.28,14.86 CONN7.SIG2
  Bottom 0.3: BR4.2 70.07,9.59 70.07,11.17 69.28,11.96 CONN7.SIG2
N$37
  Top 0.203: R31.2 36.29,41.77 LED2.A
OCS_N1  (via drill 0.4)
  Top 0.178: U1.13 v48.94,32.82 | 13.79,23.48 v13.8,23.49 13.77,23.52 U4.2
  Bottom 0.178: 83.45,14.2 83.45,8.39 78.67,3.6 11.55,3.6 7.42,7.73 7.42,19.24 11.04,22.86 13.17,22.86 v13.8,23.49 | v48.94,32.82 v48.95,32.82
  Bottom 0.18: v48.95,32.82 49.02,32.82 50.6,34.4 59.2,34.4 65.8,27.8 65.8,26.2 74,18 79.65,18 83.45,14.2
OCS_N2  (via drill 0.4)
  Top 0.178: U1.17 47.67,34.82 48.17,35.32 v48.17,35.82 | 16.25,24.75 v16.29,24.71 16.2,24.8 U4.3
  Bottom 0.178: v16.29,24.71 16.29,25.93 14.36,27.86 14.36,35.21 28.86,49.71 61.2,49.71 63.75,49.71 72.35,41.11 72.35,35.3 72.55,35.1 79.42,35.1 81.49,33.03 81.49,32.88
  Bottom 0.18: v48.17,35.82 58.98,35.82 66.6,28.2 66.6,26.6 74.4,18.8 78.8,18.8 81.49,21.49 81.49,32.88
OCS_N3  (via drill 0.4, 0.4 pad 0.7)
  Top 0.178: 15.74,29.25 v16.07,28.92 15.39,29.59 U5.2
  Top 0.18: U1.19 45.83,36.6 46.43,37.2 v47.99,37.2
  Bottom 0.178: v16.07,28.92 15.08,29.91 15.08,34.68 29.08,48.68 | 80.72,32.43 80.72,32.6 79.01,34.31 72.22,34.31 71.57,34.96 71.57,40.74 63.63,48.68 61.06,48.68
  Bottom 0.18: v47.99,37.2 59,37.2 66.57,29.58 67.43,28.71 67.5,28.62 67.49,28.61 67.49,26.94 74.79,19.64 78.48,19.64 80.72,21.88 80.72,32.43 | 61.06,48.68 29.08,48.68
OCS_N4  (via drill 0.4)
  Top 0.178: 15.85,30.52 v16,30.36 15.49,30.86 U5.3
  Top 0.18: U1.21 44.82,37.02 46.6,38.8 v48,38.8 48.05,38.8
  Bottom 0.178: 18.6,33.8 18.6,32.96 v16,30.36 | 75.05,20.55 78.33,20.55 79.93,22.15 79.93,32.09 78.53,33.49 71.91,33.49 70.76,34.64 70.76,40.39 63.2,47.95 60.73,47.95 30.1,47.95 18.6,36.45
  Bottom 0.18: 75.05,20.55 68.4,27.2 68.4,29 58.6,38.8 v48,38.8 | 18.6,36.45 18.6,33.8
PLLFILT
  Top 0.18: C43.1 38.3,31.29 39.33,32.32 U1.34
PRTPWR1  (via drill 0.4)
  Top 0.178: U1.12 47.68,32.32 v48.99,31.41 | v14.66,21.62 14.07,22.2 14.03,22.25 U4.1
  Bottom 0.178: v48.99,31.41 49.05,31.55 49.15,31.55 | 83,14 83,8.65 78.48,4.13 11.87,4.13 7.97,8.03 7.97,18.72 10.87,21.62 v14.66,21.62
  Bottom 0.18: 49.15,31.55 49.15,31.75 51.2,33.8 59.2,33.8 65.4,27.6 65.4,26 73.85,17.55 79.45,17.55 83,14
PRTPWR2  (via drill 0.4)
  Top 0.178: U1.16 48.16,34.32 48.92,35.08 v49.39,35.08 v49.4,35.09 | v14.29,26.02 14.24,26.07 U4.4
  Bottom 0.178: v14.29,26.02 13.97,26.34 13.97,35.45 28.66,50.14 61.38,50.14 63.92,50.14 72.78,41.28 72.78,35.84 73.11,35.51 79.62,35.51 81.89,33.24 81.89,33.09
  Bottom 0.18: v49.4,35.09 59.11,35.09 66.2,28 66.2,26.4 74.2,18.4 78.96,18.4 81.89,21.33 81.89,33.09
PRTPWR3  (via drill 0.4)
  Top 0.178: U1.18 46.57,36.04 v47.04,36.51 | 15.65,27.98 v16.11,27.52 15.3,28.32 U5.1
  Bottom 0.178: v16.11,27.52 14.72,28.91 14.72,34.98 28.92,49.18 61.17,49.18 63.73,49.18 71.96,40.95 71.96,35.1 72.37,34.69 79.23,34.69 81.11,32.81 81.11,32.67
  Bottom 0.18: v47.04,36.51 58.98,36.51 67,28.49 67,26.8 74.6,19.2 78.6,19.2 81.11,21.71 81.11,32.67
PRTPWR4  (via drill 0.4, 0.4 pad 0.7)
  Top 0.178: 15.78,31.79 v15.95,31.61 15.43,32.13 U5.4
  Top 0.18: U1.20 45.35,36.75 46.6,38 v47.2,38
  Bottom 0.178: 18,35 18,33.66 v15.95,31.61 | 80.31,32.23 80.31,32.43 78.82,33.92 72.07,33.92 71.18,34.81 71.18,40.56 63.42,48.32 60.9,48.32 29.52,48.32 29.51,48.31
  Bottom 0.18: 18,35 18,36.8 29.51,48.31 | v47.2,38 58.8,38 67.95,28.85 67.95,27.1 69.4,25.65 71.6,23.4 74.9,20.1 78.41,20.1 80.31,22 80.31,32.23
PWR_IC_CN1_VBUS  (via drill 0.4)
  Top 0.3: v15.91,6.78 9.97,6.78 v5.24,11.51 | FB3.2 6.42,12.71 5.86,13.27 C27.1 | C27.1
  Top 0.4: v5.25,11.52 v5.24,11.51 v5.25,11.52 C27.1 | C23.+ 8.84,17.4 8.84,16.94 8.58,16.68 v6.67,16.68 | v6.67,16.68 v6.66,16.67 v6.67,16.68 | 8.85,18.37 C23.+ | U4.8 8.26,22.25 8.3,22.2 8.85,21.66 8.85,18.21 C23.+
  Bottom 0.3: BR1.3 17.05,7.92 v15.91,6.78
  Bottom 0.4: v5.24,11.51 6.26,11.51 6.66,11.91 v6.66,16.67
PWR_IC_CN2_VBUS  (via drill 0.4)
  Top 0.4: C20.+ 25.91,18.5 26.45,19.05 28.78,19.05 C21.1 FB4.2 28.82,13.52 30.81,11.52 30.81,8.37 v32.84,6.34 v32.85,6.34 31.65,5.14 10.07,5.14 2.5,12.71 2.5,24.98 3.53,26.01 6.11,26.01 U4.5
  Bottom 0.4: v32.85,6.34 v32.85,6.35 BR2.3
PWR_IC_CN3_VBUS  (via drill 0.4)
  Top 0.4: v49.62,2.29 v49.6,6.35 v49.61,6.36 47.53,8.44 47.53,11.88 45.95,13.46 FB5.2 C26.1 45.84,19.1 44.2,19.1 43.61,18.51 C25.+ | U5.8 3.96,28.32 v3.64,28
  Bottom 0.4: BR3.3 51.05,7.71 49.72,6.38 49.61,6.38 v49.61,6.36 | 49.55,2.29 v49.62,2.29 | 2.48,11.83 2.48,26.84 v3.64,28
  Bottom 0.406: 2.48,11.83 12.02,2.29 v49.62,2.29
PWR_IC_CN4_VBUS  (via drill 0.6)
  Top 0.4: v66.7,6.27 66.38,6.27 64.9,7.75 64.9,11.6 62.85,13.64 FB6.2 C30.1 62.85,19 62.85,19.05 60.24,19.05 C29.+ | 1.5,12.41 1.5,30.61 2.51,31.62 | 2.51,31.62 2.68,31.79 | U5.5 3.02,32.13 2.51,31.62
  Top 0.406: 1.5,12.41 12.66,1.25 64.91,1.25 66.7,3.04 v66.7,6.27
  Bottom 0.406: v66.7,6.27 66.75,6.27 BR4.3 67.89,7.57 66.67,6.35
RBIAS
  Top 0.18: R34.2 38.71,29.77 38.98,30.04 38.98,31.43 39.35,31.81 U1.35
REM0
  Top 0.18: U1.28 40.28,35.32 39.8,35.8 39.8,36.8 39.2,37.4 39.2,37.8 38.8,38.2 38.01,38.2 R30.2
  Top 0.203: R30.2 37.98,40.27 R31.1
REM1  (via drill 0.4)
  Top 0.178: U1.22 44.32,37.2 46.59,39.47 v46.59,39.94 v46.6,39.95 | v60.98,40.05 60.98,35.93 60.46,35.41 57.34,35.41 R40.1 57.3,35.38 R37.2
  Top 0.25: U2.5 R37.2
  Bottom 0.178: v46.6,39.95 46.6,42.82 47.3,43.52 60.37,43.52 60.96,42.93 60.96,40.07 v60.98,40.05
RST_U2U_RST
  Top 0.178: C40.1 41.29,41.3 R32.2
  Top 0.203: U1.26 42.32,37.17 41.33,38.16 R32.2
SCL  (via drill 0.4)
  Top 0.178: U1.24 43.32,37.85 44.11,38.64 v44.11,39.99 | v62.5,41 62.5,32.74 62.05,32.29 U2.6 | R39.1 R36.2 58.17,31.38 59.08,32.28 60.27,32.28 U2.6 | U2.6 60.21,32.29 60,32.5
  Bottom 0.178: v44.11,39.99 44.11,43.23 45.01,44.13 60.81,44.13 61.53,43.41 61.53,41.97 v62.5,41
SEL1
  Top 0.178: 43.41,41.26 R35.2 | 45.45,41.27 R35.2 | R35.2 R38.1
  Top 0.203: U1.25 42.82,38.12 43.36,38.66 R38.1
USBDN1_U2U_USBCON_N
  Top 0.178: U1.1 41.82,29.94 39.8,27.93 39.8,27.97 39.73,28.05 | R5.1 16.46,18.02 L1.4 16.77,19.81 16.87,19.91 16.87,20.38 16.73,20.38
  Top 0.46: 39.73,28.05 36,24.32 18.99,24.32 16.73,22.06 16.73,20.38
USBDN1_U2U_USBCON_P
  Top 0.178: U1.2 42.32,29.94 40.06,27.67 40.06,27.48 40.04,27.46 | R7.2 17.65,18.02 L1.1 17.32,19.81 17.23,19.91 17.23,20.38 17.37,20.38
  Top 0.46: 40.17,27.59 40.04,27.46 36.26,23.68 19.25,23.68 17.37,21.8 17.37,20.38
USBDN1_U2U_USBCON_P2
  Top 0.178: R2.2 67.69,16.71 L4.3
  Top 0.3: L4.3 68.01,15.57 67.28,14.85 CONN7.SIG1
  Bottom 0.3: BR4.4 66.2,9.42 66.2,11.2 67.28,12.29 CONN7.SIG1
USBDN1_U2U_USBCON_P3
  Top 0.178: R3.2 50.6,16.72 L3.3
  Top 0.3: L3.3 50.93,15.55 50.2,14.83 CONN6.SIG1
  Bottom 0.3: BR3.4 49,9.79 49,11 50.2,12.21 CONN6.SIG1
USBDN1_U2U_USBCON_P4
  Top 0.178: R4.2 33.53,16.71 L2.3
  Top 0.3: L2.3 33.85,15.59 33.13,14.87 CONN5.SIG1
  Bottom 0.3: BR2.4 32,9.6 32,11 33.13,12.13 CONN5.SIG1
USBDN1_U2U_USBCON_P5
  Top 0.178: R5.2 16.44,16.73 L1.3
  Top 0.3: L1.3 16.77,15.57 16.05,14.85 CONN4.SIG1
  Bottom 0.178: BR1.4 15.63,9.37 | 15,11 15.01,11
  Bottom 0.3: 15.63,9.37 15,10 15,11 | 15.01,11 16.05,12.04 CONN4.SIG1
USBDN2_U2U_USBCON_N
  Top 0.178: U1.3 42.82,29.47 41.65,28.3 41.65,27.41 41.05,26.82 41.05,26.98 41.03,27 | R4.1 33.52,18.01 L2.4 33.85,19.73 33.95,19.83 33.95,20.34 33.81,20.48
  Top 0.46: 41.03,27 36.83,22.79 35.38,22.79 33.81,21.22 33.81,20.48 33.81,20.32
USBDN2_U2U_USBCON_P
  Top 0.178: U1.4 43.32,29.47 42.01,28.16 42.01,27.27 41.31,26.56 41.47,26.56 41.48,26.55 | R14.2 34.73,18.02 L2.1 34.41,19.73 34.31,19.83 34.31,20.32 34.45,20.32
  Top 0.46: 41.48,26.55 37.09,22.15 35.64,22.15 34.45,20.96 34.45,20.32
USBDN3_U2U_USBCON_N
  Top 0.178: U1.6 44.32,29.51 45.67,28.16 45.67,27.22 46.21,26.67 46.12,26.57 | R3.1 50.61,18.02 L3.4 50.93,19.7 51.03,19.8 51.03,20.24 50.89,20.24
  Top 0.46: 46.12,26.57 50.89,21.8 50.89,20.24
USBDN3_U2U_USBCON_P
  Top 0.178: U1.7 44.82,29.51 46.03,28.3 46.03,27.36 46.47,26.93 46.58,26.93 46.62,26.97 | R15.2 51.8,18.02 L3.1 51.48,19.7 51.38,19.8 51.38,20.24 51.52,20.24
  Top 0.46: 46.56,27.02 46.62,26.97 51.52,22.07 51.52,20.24
USBDN4_U2U_USBCON_N
  Top 0.178: U1.8 45.32,29.86 47.53,27.64 47.48,27.59 47.38,27.59 | R2.1 67.68,18.01 L4.4 68.01,19.49 68.11,19.59 68.11,20 67.97,20
  Top 0.46: 47.38,27.59 51.09,23.89 64.76,23.89 67.97,20.69 67.97,20
USBDN4_U2U_USBCON_P
  Top 0.178: U1.9 45.82,29.86 47.79,27.9 47.9,27.9 47.94,27.94 | R16.2 68.89,18.02 L4.1 68.56,19.49 68.46,19.59 68.46,20 68.6,20
  Top 0.46: 47.84,28.05 47.94,27.94 51.35,24.53 65.03,24.53 68.6,20.95 68.6,20
USBUP_USBCON_U2U_N
  Top 0.178: U1.30 39.04,34.32 38.13,35.23 37.51,35.23 37.51,35.37 | CONN2.D- 74.66,28.41 74.4,28.67 73.95,28.67 73.95,28.53
  Top 0.46: 37.51,35.37 32.73,35.37 31.4,36.7 31.4,43.45 33.37,45.42 62.7,45.42 68.47,39.65 68.47,31.88 71.82,28.53 73.95,28.53
USBUP_USBCON_U2U_P
  Top 0.178: U1.31 39.04,33.82 37.99,34.87 37.55,34.87 | 37.55,34.87 37.51,34.87 | 37.51,34.73 37.55,34.73 37.55,34.87 | CONN2.D+ 74.58,29.21 74.4,29.03 73.95,29.03 73.95,29.17
  Top 0.46: 37.51,34.73 32.47,34.73 30.76,36.44 30.76,43.71 33.15,46.1 63.1,46.1 69.21,39.99 69.21,32.04 72.08,29.17 73.95,29.17
VBUS_UP
  Top 0.18: C39.1 79.02,20.21 78.8,20 R28.2 77.41,19.39 76.5,20.3 76.5,21.75 76,22.25 73.85,22.25 73.05,23.05 73.05,24.71 72.64,25.12 D2.1
  Top 0.4: D2.1 C22.1 72.9,27.15 73.36,27.61 CONN2.VBUS
VBUS_UPSTREAM  (via drill 0.4, 0.4 pad 0.7)
  Top 0.178: R28.1 78.79,17.68 73.31,17.68 66.88,24.1 66.88,38.46 63.28,42.06 63.28,43.93 62.29,44.92 38.15,44.92 37.94,44.71 v37.94,44.04
  Top 0.18: R29.1 79.11,16.7 78.8,17 78.8,17.68 R28.1
  Top 0.203: U1.27 40.93,36.07 40.2,36.8 v40.2,37.78
  Bottom 0.178: v40.2,37.78 40.2,37.8 37.94,40.06 v37.94,44.04
VCC  (via drill 0.4)
  Top 0.18: D3.1 D3.2
  Top 0.25: C7.1 58.33,43.16 U3.3 U3.4
  Top 0.406: D3.2 41.38,52.53 41.91,52 43.37,52 43.65,52
  Top 0.5: v64.51,41.97 67.73,38.75 67.73,24.39 69.2,22.92 D2.3 | U3.4 C7.1 | 70.73,22.9 D2.3 | D2.3 72.07,22.92 73.64,21.35 v75.39,21.35 | D1.P$2 v45.96,47.18
  Top 0.8: C7.1 58.5,43 v62.5,43 | F1.1 25.19,50.07 18.8,43.68 18.8,35.48 18.8,34.56 17.83,33.59 17.46,33.22 9.72,33.22 8.87,32.37 8.87,30.09 8.38,29.59 | U4.7 8.03,23.52 8.85,24.35 | 8.85,24.35 8.87,24.37 | U5.7 8.38,29.59 | 8.85,24.35 8.85,29.12 8.38,29.59
  Top 1.5: D1.P$2 43.65,52 | 43.37,52 42.84,52.53 34.36,52.53 33.85,53.03 C1.+ F1.1
  Bottom 0.5: v75.39,21.35 78.35,21.35 79.33,22.33 79.33,31.93 78.3,32.96 71.65,32.96 70.17,34.44 70.17,40.16 63.35,46.98 60.83,46.98 46.16,46.98 v45.96,47.18
  Bottom 0.8: v62.5,43 63.5,43 v64.51,41.97

### Text on the board
Top: TOP
Bottom: BOTTOM
Dimension: 10LA.org_4PxU_RPi Rev B 18July2014
tPlace: Raspiado v.B by 10LA.org
tNames: TOP ASSEMBLY
bNames: BOT ASSEMBLY
tStop: TOP MASK
bStop: BOT MASK
tCream: TOP PASTE
bCream: BOT PASTE
Drills: DRILL IDENT
Measures: ALL DIMENSIONS ARE IN MILLIMETERS | NONE | v.1.0 | AMTIxxxxx | DO NOT SCALE | AMTI | 4PxU_RPiSB